# Altium project TC264MCU_V2_Project.PrjPcb
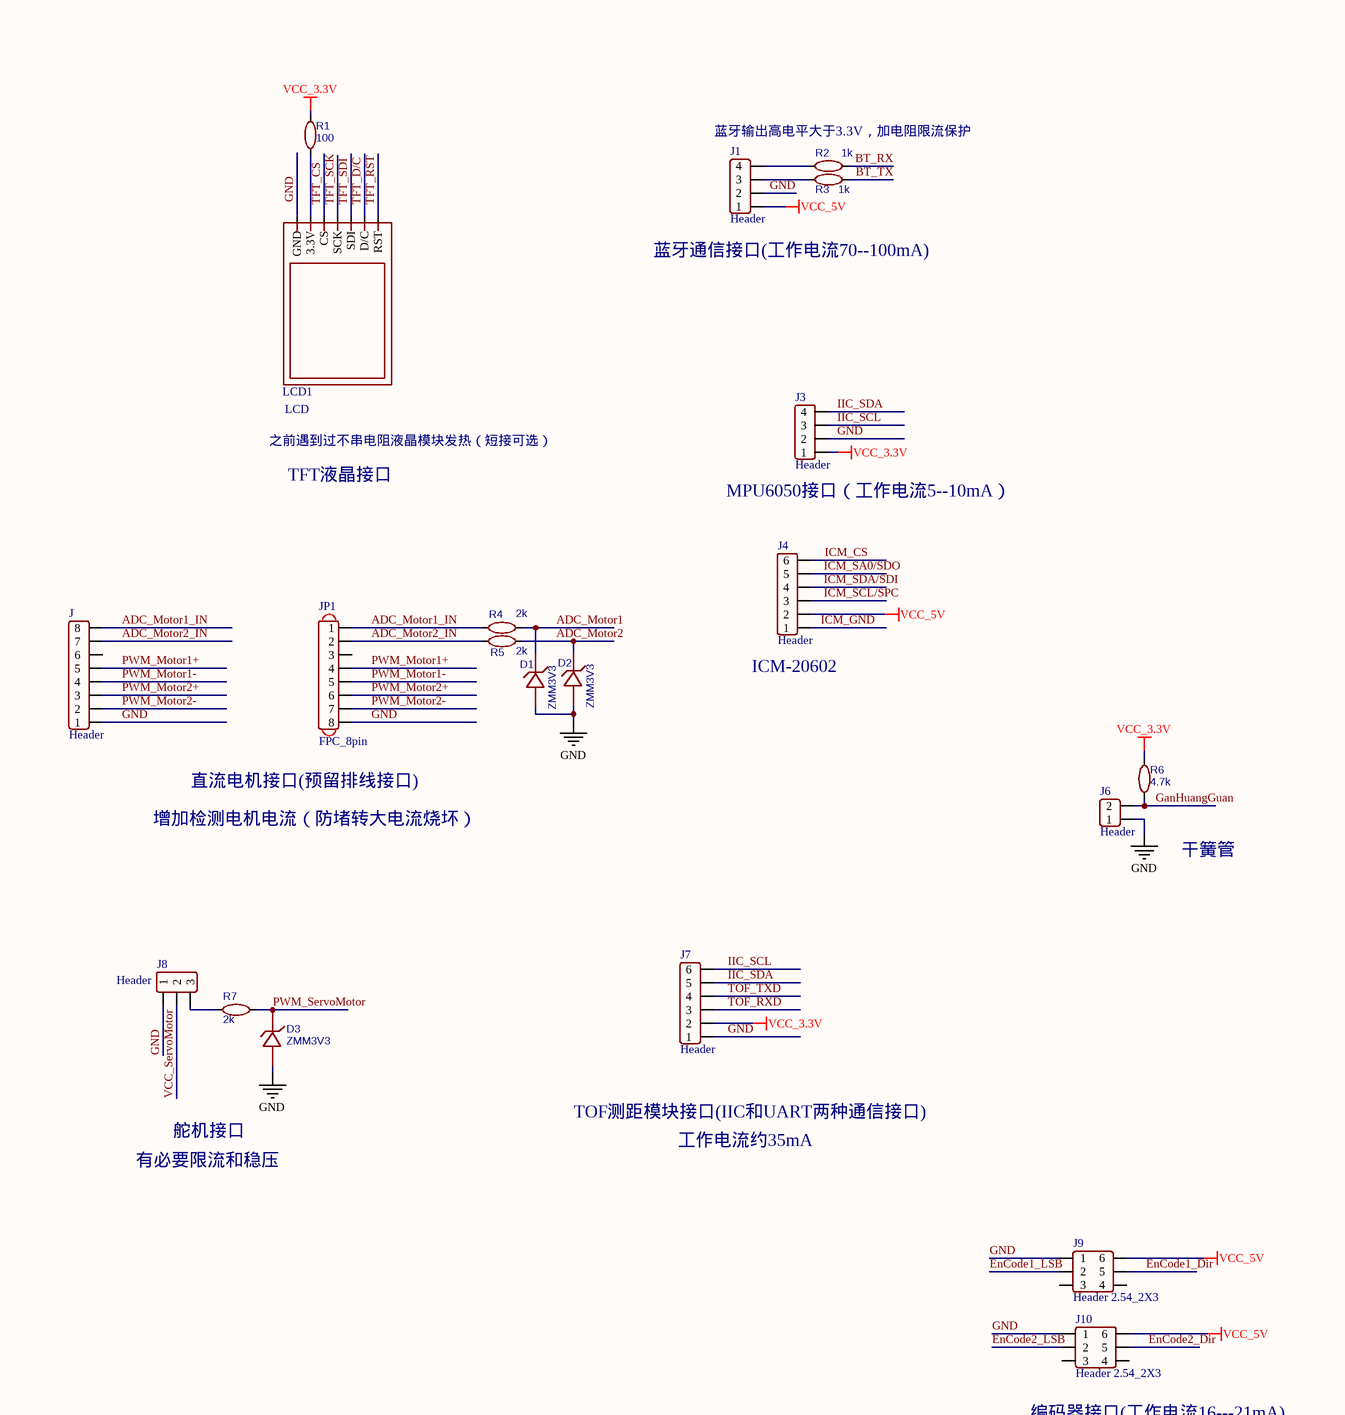
[diagram p0: TC264MCUV02.SchDoc, top left]
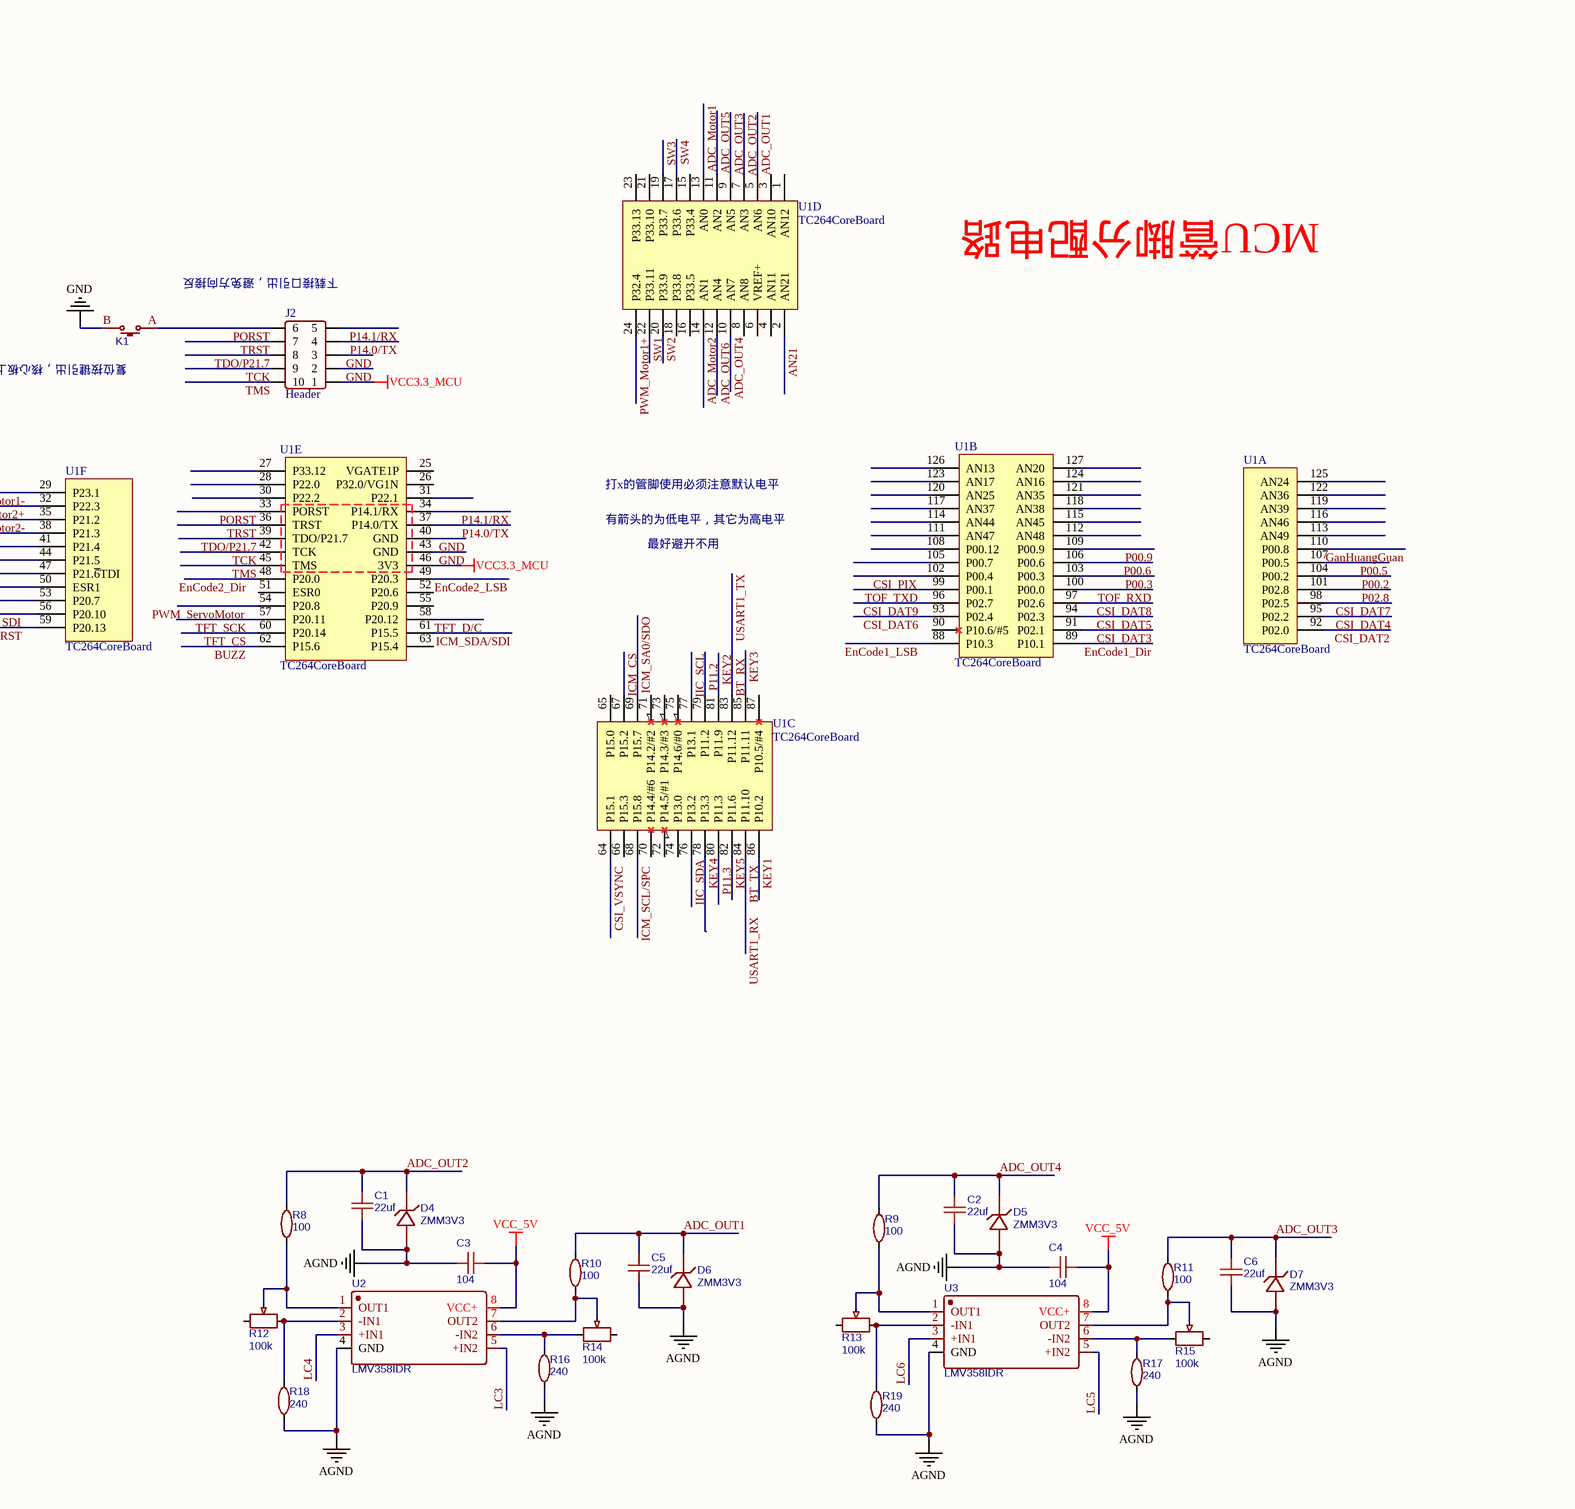
[diagram p1: TC264MCUV02.SchDoc, top right]
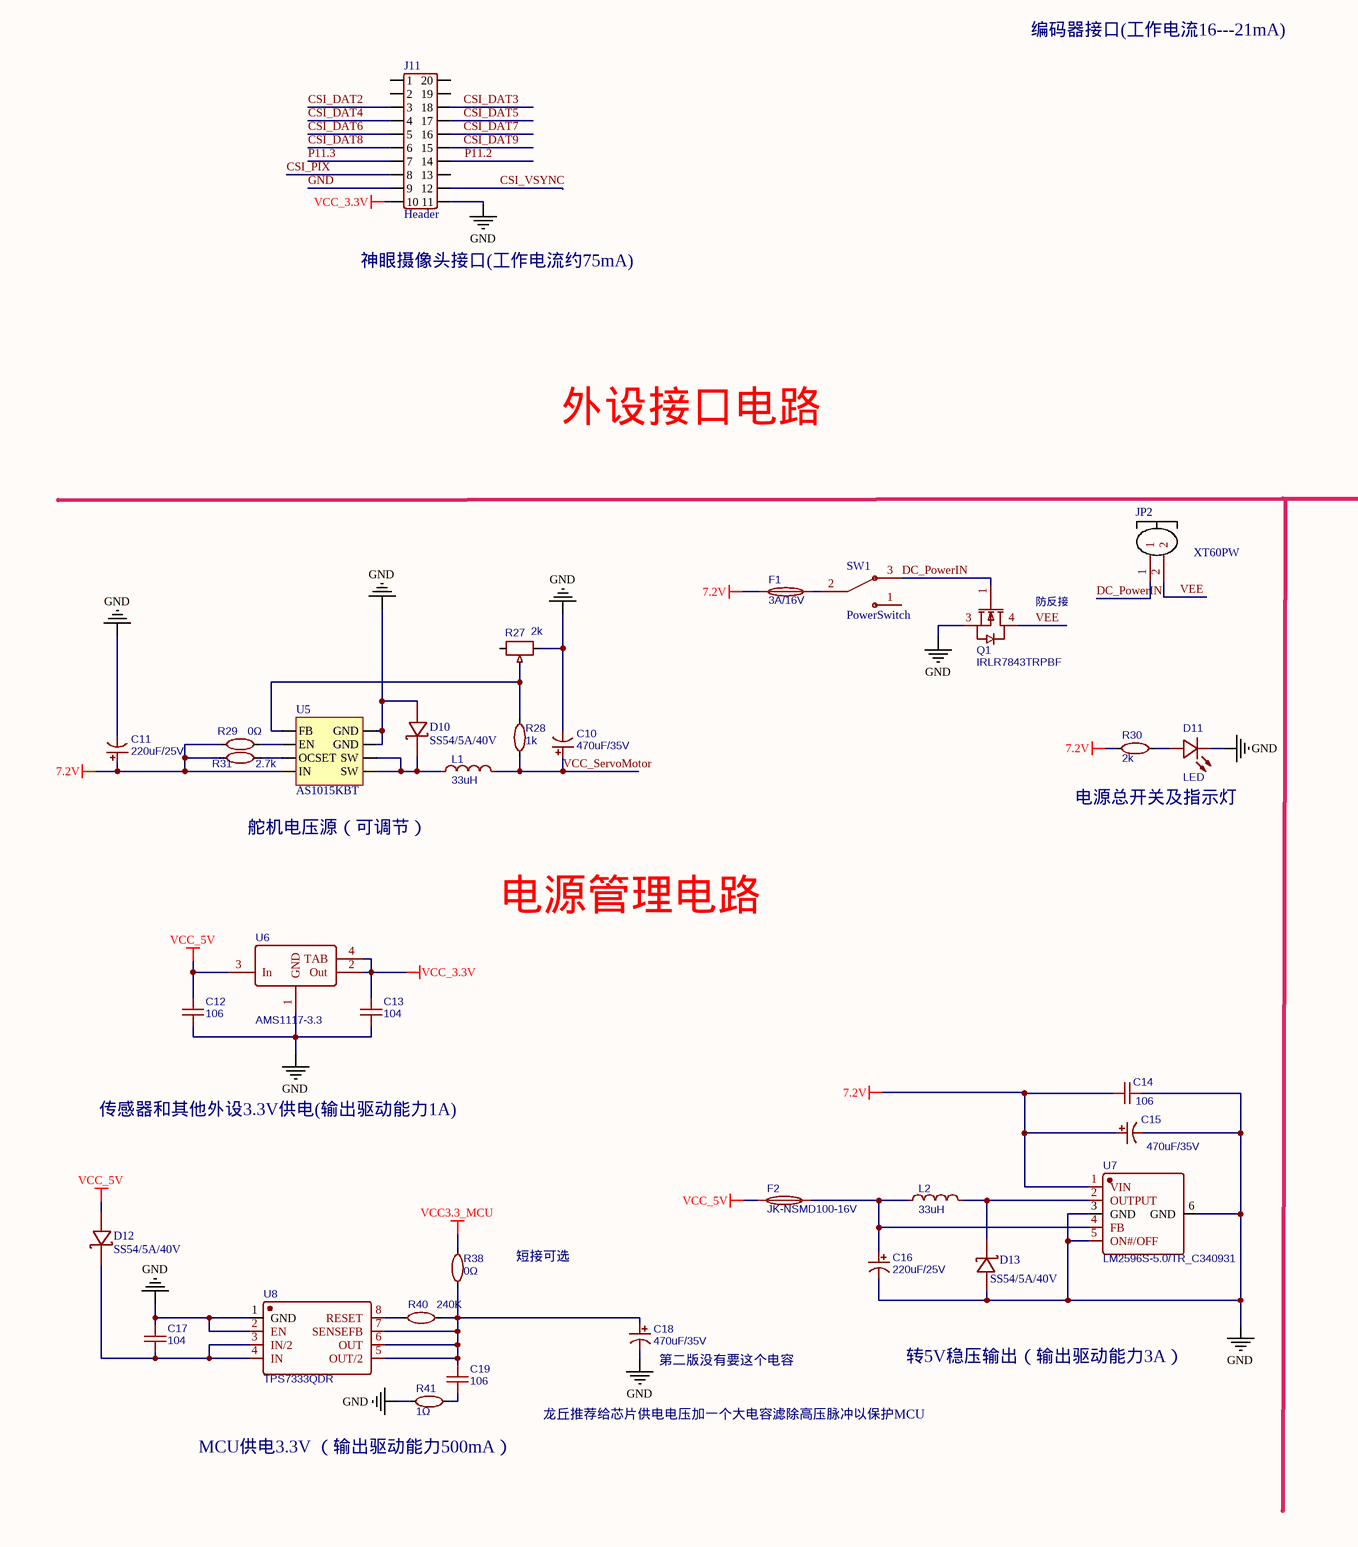
[diagram p2: TC264MCUV02.SchDoc, bottom left]
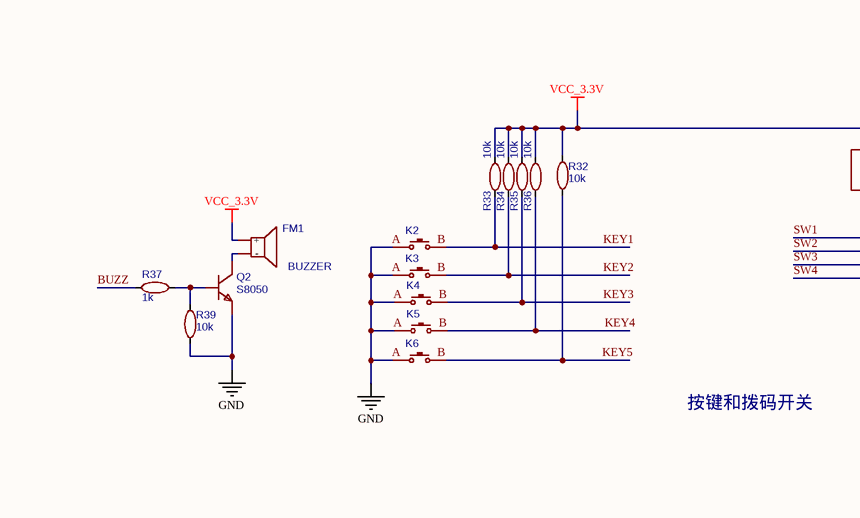
[diagram p3: TC264MCUV02.SchDoc, bottom middle]
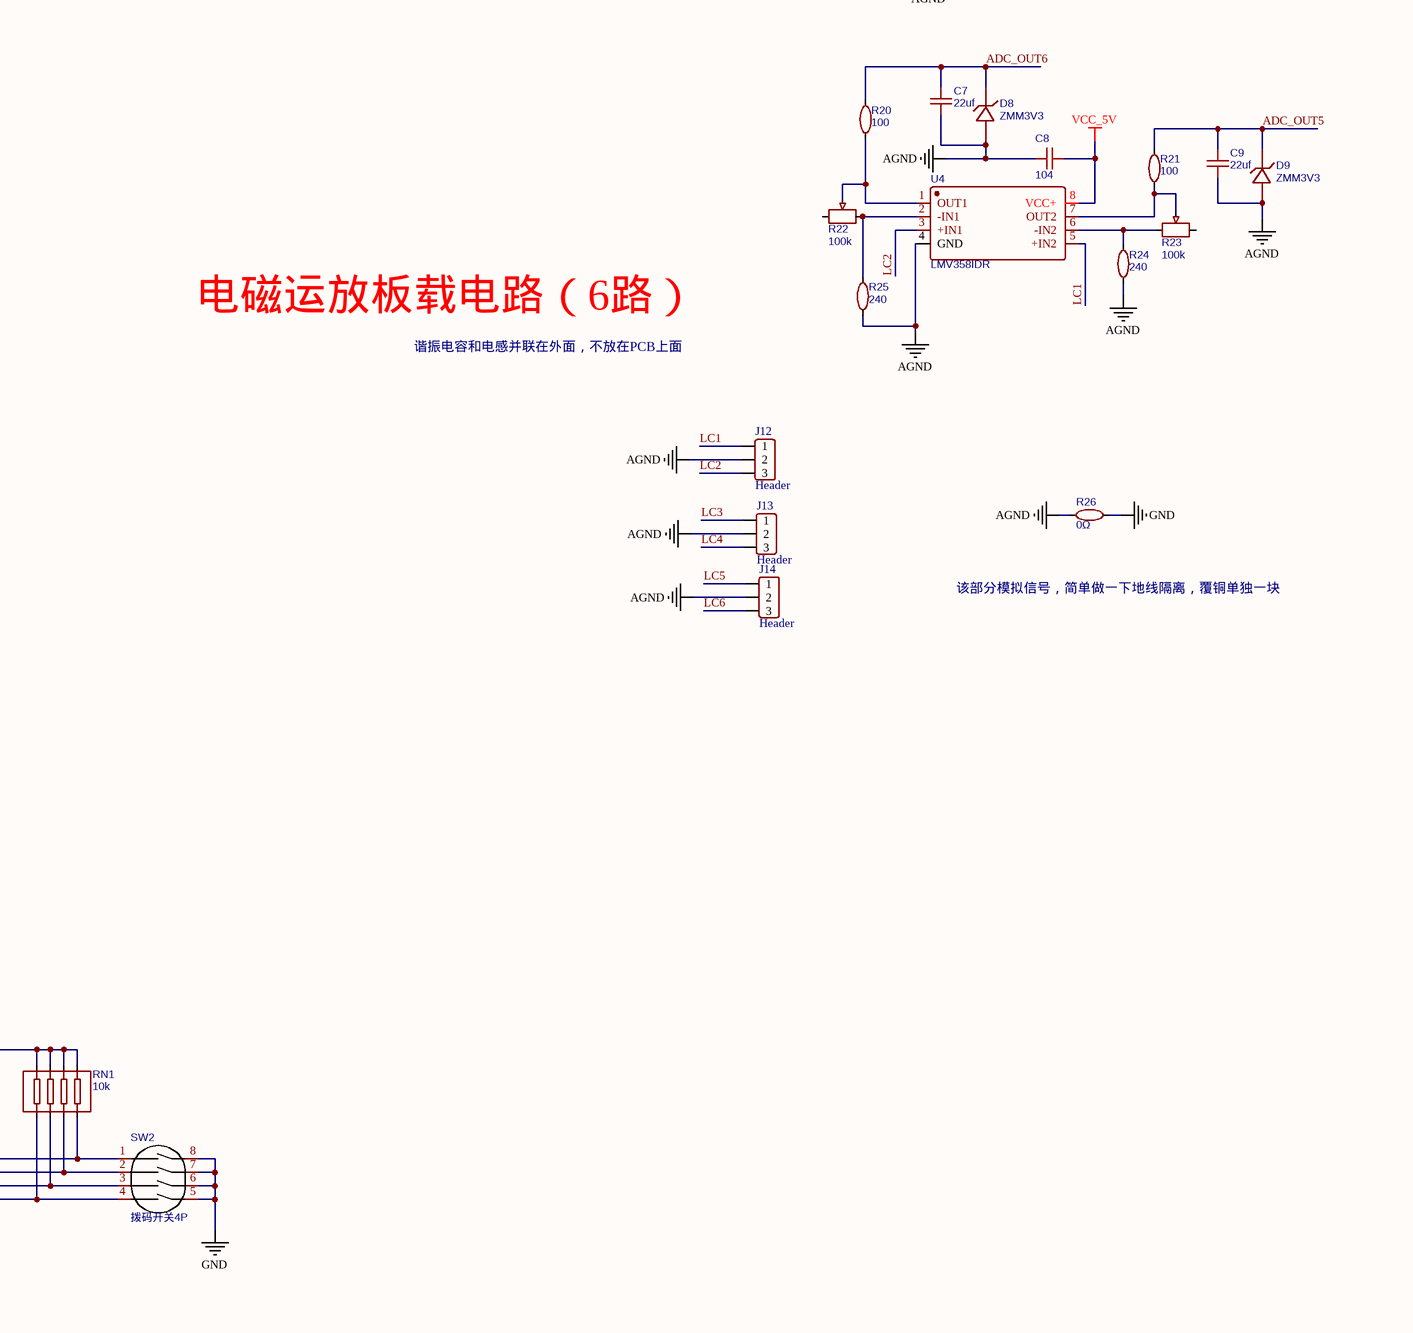
[diagram p4: TC264MCUV02.SchDoc, bottom right]
1 sheet, 114 parts. Net scope: global (net labels, ports and power ports of the same name join across sheets).
Board files: TC264MCUV02.PcbDoc, CarSizeofCforFourRounds.PcbDoc

## Sheet TC264MCUV02.SchDoc
size A1

### Parts
C1  22uf  [CAP_0603]
C2  22uf  [CAP_0603]
C3  104  [CAP_0603]
C4  104  [CAP_0603]
C5  22uf  [CAP_0603]
C6  22uf  [CAP_0603]
C7  22uf  [CAP_0603]
C8  104  [CAP_0603]
C9  22uf  [CAP_0603]
C10  470uF/35V  [CAPE_SMD_F_8.4]
C11  220uF/25V  [CAPE_SMD_F_8.4]
C12  106  [CAP_0603]
C13  104  [CAP_0603]
C14  106  [CAP_0603]
C15  470uF/35V  [CAPE_SMD_G_10.6]
C16  220uF/25V  [CAPE_SMD_F_8.4]
C17  104  [CAP_0603]
C18  470uF/35V  [CAPE_SMD_G_10.6]
C19  106  [CAP_0603]
D1  ZMM3V3  [LL-34_L3.5-W1.5-RD]
D2  ZMM3V3  [LL-34_L3.5-W1.5-RD]
D3  ZMM3V3  [LL-34_L3.5-W1.5-RD]
D4  ZMM3V3  [LL-34_L3.5-W1.5-RD]
D5  ZMM3V3  [LL-34_L3.5-W1.5-RD]
D6  ZMM3V3  [LL-34_L3.5-W1.5-RD]
D7  ZMM3V3  [LL-34_L3.5-W1.5-RD]
D8  ZMM3V3  [LL-34_L3.5-W1.5-RD]
D9  ZMM3V3  [LL-34_L3.5-W1.5-RD]
D10  SS54/5A/40V  [DO214_SMA]
D11  LED  [LED_0603_B]
D12  SS54/5A/40V  [DO214_SMA]
D13  SS54/5A/40V  [DO214_SMA]
F1  3A/16V  [FUSE_1210]
F2  JK-NSMD100-16V  [F1206]
FM1  BUZZER  [BUZZ-12*7.5]
J  Header  [Header 2.54X8]
J1  Header  [Header F 2.54X4]
J2  Header  [IDC_10P]
J3  Header  [Header 2.54X4]
J4  Header  [Header 2.54X6]
J6  Header  [HX2.54-2]
J7  Header  [Header 2.54X6]
J8  Header  [Header 2.54X3]
J9  Header 2.54_2X3  [IDC_6P]
J10  Header 2.54_2X3  [IDC_6P]
J11  Header  [Header F 2.54_2x10]
J12  Header  [Header 2.54X3]
J13  Header  [Header 2.54X3]
J14  Header  [Header 2.54X3]
JP1  FPC_8pin  [FPC_1.0_8P]
JP2  XT60PW  [XT60PW]
K1  TS-Button_2P  [SW_SMD_6.1*3.7]  (value not drawn)
K2  TS-Button_2P  [SW_SMD_6.1*3.7]  (value not drawn)
K3  TS-Button_2P  [SW_SMD_6.1*3.7]  (value not drawn)
K4  TS-Button_2P  [SW_SMD_6.1*3.7]  (value not drawn)
K5  TS-Button_2P  [SW_SMD_6.1*3.7]  (value not drawn)
K6  TS-Button_2P  [SW_SMD_6.1*3.7]  (value not drawn)
L1  33uH  [IND-SMD_L8.0-W8.0]
L2  33uH  [IND-SMD_L8.0-W8.0]
LCD1  LCD  [TFT_LCD]
Q1  IRLR7843TRPBF  [TO-252-2]
Q2  S8050  [SOT-23-3]
R1  100  [RES_0603]
R2  1k  [RES_0603]
R3  1k  [RES_0603]
R4  2k  [RES_0603]
R5  2k  [RES_0603]
R6  4.7k  [RES_0603]
R7  2k  [RES_0603]
R8  100  [RES_0603]
R9  100  [RES_0603]
R10  100  [RES_0603]
R11  100  [RES_0603]
R12  100k  [RES_POT-3296W]
R13  100k  [RES_POT-3296W]
R14  100k  [RES_POT-3296W]
R15  100k  [RES_POT-3296W]
R16  240  [RES_0603]
R17  240  [RES_0603]
R18  240  [RES_0603]
R19  240  [RES_0603]
R20  100  [RES_0603]
R21  100  [RES_0603]
R22  100k  [RES_POT-3296W]
R23  100k  [RES_POT-3296W]
R24  240  [RES_0603]
R25  240  [RES_0603]
R26  0Ω  [RES_0603]
R27  2k  [RES_POT-3296W]
R28  1k  [RES_0603]
R29  0Ω  [RES_0603]
R30  2k  [RES_0603]
R31  2.7k  [RES_0603]
R32  10k  [RES_0603]
R33  10k  [RES_0603]
R34  10k  [RES_0603]
R35  10k  [RES_0603]
R36  10k  [RES_0603]
R37  1k  [RES_0603]
R38  0Ω  [RES_0603]
R39  10k  [RES_0603]
R40  240K  [RES_0603]
R41  1Ω  [RES_0603]
RN1  10k  [RES-ARRAY-SMD_0603-8P-L3.2-W1.6-BL]
SW1  PowerSwitch  [SW-TH_K3-1260D-K1]
SW2  拨码开关4P  [VDG/S-04HG-R]
U1  TC264CoreBoard  [LQ-TC264-SYSVC-S]  (parts A,B,C,D,E,F of 6)
U2  LMV358IDR  [SOIC-8_150MIL]
U3  LMV358IDR  [SOIC-8_150MIL]
U4  LMV358IDR  [SOIC-8_150MIL]
U5  AS1015KBT  [SOIC-8_150MIL]
U6  AMS1117-3.3  [SOT-223_3]
U7  LM2596S-5.0/TR_C340931  [TO-263_5]
U8  TPS7333QDR  [SOIC-8_150MIL]

### Nets
7.2V: C11.1 C14.1 C15.1 F1.2 R29.1 R30.2 R31.1 U5.4(IN) U7.1(VIN)
AGND: C1.2 C2.2 C3.2 C4.2 C5.2 C6.2 C7.2 C8.2 C9.2 D4.2(A) D5.2(A) D6.2(A) D7.2(A) D8.2(A) D9.2(A) J12.2 J13.2 J14.2 R16.1 R17.1 R18.2 R19.2 R24.1 R25.2 R26.1 U2.4(GND) U3.4(GND) U4.4(GND)
GND: C10.2 C11.2 C12.2 C13.2 C14.2 C15.2 C16.2 C17.1 C18.2 D1.2(A) D2.2(A) D3.2(A) D10.1(A) D11.C D13.1(A) J.1 J1.2 J2.2 J2.3 J3.2 J6.1 J7.1 J8.1 J9.1 J10.1 J11.9 J11.11 JP1.8 K1.B K2.A K3.A K4.A K5.A K6.A LCD1.1(GND) Q1.3(S) Q2.2(E) R26.2 R27.1 R39.2 R41.1 SW2.5 SW2.6 SW2.7 SW2.8 U1.40(GND) U1.43(GND) U5.7(GND) U5.8(GND) U6.1(GND) U7.3(GND) U7.5(ON#/OFF) U7.6(GND) U8.1(GND) U8.2(EN)
VCC3.3_MCU: J2.1 R38.2 U1.46(3V3)
VCC_3.3V: C13.1 FM1.1(+) J3.1 J7.2 J11.10 R1.1 R6.1 R32.2 R33.2 R34.2 R35.2 R36.2 RN1.5 RN1.6 RN1.7 RN1.8 U6.2(Out) U6.4(TAB)
VCC_5V: C3.1 C4.1 C8.1 C12.1 D12.1(A) F2.2 J1.1 J4.2 J9.6 J10.6 U2.8(VCC+) U3.8(VCC+) U4.8(VCC+) U6.3(In)
ADC_Motor1: D1.1(C) R4.1 U1.13(AN0)
ADC_Motor1_IN: J.8 JP1.1 R4.2
ADC_Motor2: D2.1(C) R5.1 U1.14(AN1)
ADC_Motor2_IN: J.7 JP1.2 R5.2
ADC_OUT1: C5.1 D6.1(C) R10.1 U1.5(AN6)
ADC_OUT2: C1.1 D4.1(C) R8.1 U1.7(AN3)
ADC_OUT3: C6.1 D7.1(C) R11.1 U1.9(AN5)
ADC_OUT4: C2.1 D5.1(C) R9.1 U1.10(AN7)
ADC_OUT5: C9.1 D9.1(C) R21.1 U1.11(AN2)
ADC_OUT6: C7.1 D8.1(C) R20.1 U1.12(AN4)
AN21: U1.2(AN21)
BT_RX: R2.1 U1.83(P11.12)  [also labelled USART1_TX]
BT_TX: R3.1 U1.84(P11.10)  [also labelled USART1_RX]
BUZZ: R37.2 U1.62(P15.6)
CSI_DAT2: J11.3 U1.92(P02.0)
CSI_DAT3: J11.18 U1.91(P02.1)
CSI_DAT4: J11.4 U1.95(P02.2)
CSI_DAT5: J11.17 U1.94(P02.3)
CSI_DAT6: J11.5 U1.93(P02.4)
CSI_DAT7: J11.16 U1.98(P02.5)
CSI_DAT8: J11.6 U1.97(P02.6)
CSI_DAT9: J11.15 U1.96(P02.7)
CSI_PIX: J11.8 U1.102(P00.4)
CSI_VSYNC: J11.12 U1.64(P15.1)
DC_PowerIN: JP2.1 Q1.1(G) SW1.3(NC)
EnCode1_Dir: J9.5 U1.89(P10.1)
EnCode1_LSB: J9.2 U1.88(P10.3)
EnCode2_Dir: J10.5 U1.48(P20.0)
EnCode2_LSB: J10.2 U1.49(P20.3)
GanHuangGuan: J6.2 R6.2 U1.110(P00.8)
ICM_CS: J4.6 U1.67(P15.2)
ICM_GND: J4.1
ICM_SA0/SDO: J4.5 U1.69(P15.7)
ICM_SCL/SPC: J4.3 U1.68(P15.8)
ICM_SDA/SDI: J4.4 U1.61(P15.5)
IIC_SCL: J3.3 J7.6 U1.77(P13.1)
IIC_SDA: J3.4 J7.5 U1.76(P13.2)
KEY1: K2.B R33.1 U1.86(P10.2)
KEY2: K3.B R34.1 U1.81(P11.9)
KEY3: K4.B R35.1 U1.85(P11.11)
KEY4: K5.B R36.1 U1.78(P13.3)
KEY5: K6.B R32.1 U1.82(P11.6)
LC1: J12.1 U4.5(+IN2)
LC2: J12.3 U4.3(+IN1)
LC3: J13.1 U2.5(+IN2)
LC4: J13.3 U2.3(+IN1)
LC5: J14.1 U3.5(+IN2)
LC6: J14.3 U3.3(+IN1)
P00.2: U1.104(P00.2)
P00.3: U1.103(P00.3)
P00.5: U1.107(P00.5)
P00.6: U1.106(P00.6)
P00.9: U1.109(P00.9)
P02.8: U1.101(P02.8)
P11.2: J11.14 U1.79(P11.2)
P11.3: J11.7 U1.80(P11.3)
P14.0/TX: J2.4 U1.37(P14.0/TX)
P14.1/RX: J2.5 U1.34(P14.1/RX)
PORST: J2.6 K1.A U1.33(PORST)
PWM_Motor1+: J.5 JP1.4 U1.24(P32.4)
PWM_Motor1-: J.4 JP1.5 U1.29(P23.1)
PWM_Motor2+: J.3 JP1.6 U1.32(P22.3)
PWM_Motor2-: J.2 JP1.7 U1.35(P21.2)
PWM_ServoMotor: D3.1(C) R7.1 U1.54(P20.8)
SW1: RN1.4 SW2.1 U1.22(P33.11)
SW2: RN1.3 SW2.2 U1.20(P33.9)
SW3: RN1.2 SW2.3 U1.19(P33.7)
SW4: RN1.1 SW2.4 U1.17(P33.6)
TCK: J2.9 U1.42(TCK)
TDO/P21.7: J2.8 U1.39(TDO/P21.7)
TFT_CS: LCD1.3(CS) U1.60(P20.14)
TFT_D/C: LCD1.6(D/C) U1.58(P20.12)
TFT_RST: LCD1.7(RST) U1.59(P20.13)
TFT_SCK: LCD1.4(SCK) U1.57(P20.11)
TFT_SDI: LCD1.5(SDI) U1.56(P20.10)
TMS: J2.10 U1.45(TMS)
TOF_RXD: J7.3 U1.100(P00.0)
TOF_TXD: J7.4 U1.99(P00.1)
TRST: J2.7 U1.36(TRST)
VCC_ServoMotor: C10.1 J8.2 L1.2 R28.1
VEE: JP2.2 Q1.4(D)
NetC16_1: C16.1 F2.1 L2.1 U7.4(FB)
NetC17_2: C17.2 D12.2(C) U8.3(IN/2) U8.4(IN)
NetC18_1: C18.1 C19.1 R38.1 R40.2 U8.5(OUT/2) U8.6(OUT) U8.7(SENSEFB)
NetC19_2: C19.2 R41.2
NetD10_2: D10.2(C) L1.1 U5.5(SW) U5.6(SW)
NetD11_A: D11.A R30.1
NetD13_2: D13.2(C) L2.2 U7.2(OUTPUT)
NetF1_1: F1.1 SW1.2(C)
NetFM1_2: FM1.2(－) Q2.3(C)
NetJ1_3: J1.3 R3.2
NetJ1_4: J1.4 R2.2
NetJ8_3: J8.3 R7.2
NetLCD1_2: LCD1.2(3.3V) R1.2
NetQ2_1: Q2.1(B) R37.1 R39.1
NetR8_2: R8.2 R12.2 U2.1(OUT1)
NetR9_2: R9.2 R13.2 U3.1(OUT1)
NetR10_2: R10.2 R14.2 U2.7(OUT2)
NetR11_2: R11.2 R15.2 U3.7(OUT2)
NetR12_3: R12.3 R18.1 U2.2(-IN1)
NetR13_3: R13.3 R19.1 U3.2(-IN1)
NetR14_1: R14.1 R16.2 U2.6(-IN2)
NetR15_1: R15.1 R17.2 U3.6(-IN2)
NetR20_2: R20.2 R22.2 U4.1(OUT1)
NetR21_2: R21.2 R23.2 U4.7(OUT2)
NetR22_3: R22.3 R25.1 U4.2(-IN1)
NetR23_1: R23.1 R24.2 U4.6(-IN2)
NetR27_2: R27.2 R28.2 U5.1(FB)
NetR29_2: R29.2 U5.2(EN)
NetR31_2: R31.2 U5.3(OCSET)
NetR40_1: R40.1 U8.8(RESET)

Not connected (* = marked no-connect by the designer): J 6; J9 3 4; J10 3 4; J11 1 2 13 19 20; JP1 3; R12 1; R13 1; R14 3; R15 3; R22 1; R23 3; R27 3; SW1 1(ON); U1 1(AN12) 3(AN10) 4(AN11) 6(VREF+) 8(AN8) 15(P33.4) 16(P33.5) 18(P33.8) 21(P33.10) 23(P33.13) 25(VGATE1P) 26(P32.0/VG1N) 27(P33.12) 28(P22.0) 30(P22.2) 31(P22.1) 38(P21.3) 41(P21.4) 44(P21.5) 47(P21.~{6}TDI) 50(ESR1) 51(ESR0) 52(P20.6) 53(P20.7) 55(P20.9) 63(P15.4) 65(P15.0) 66(P15.3) 70(P14.4/#6) 71(P14.2/#2) 72(P14.5/#1) 73(P14.3/#3) 74(P13.0) 75(P14.6/#0) 87(P10.5/#4) 90(P10.6/#5) 105(P00.7) 108(P00.12) 111(AN47) 112(AN48) 113(AN49) 114(AN44) 115(AN45) 116(AN46) 117(AN37) 118(AN38) 119(AN39) 120(AN25) 121(AN35) 122(AN36) 123(AN17) 124(AN16) 125(AN24) 126(AN13) 127(AN20)

### Notes on the sheet
- 蓝牙输出高电平大于3.3V，加电阻限流保护
- MCU管脚分配电路
- (near J1) 蓝牙通信接口(工作电流70--100mA)
- (near J2) 下载接口引出，避免方向接反
- (near K1) 复位按键引出，核心板上已经加了上拉电阻和电容
- 之前遇到过不串电阻液晶模块发热（短接可选）
- 打x的管脚使用必须注意默认电平
- 有箭头的为低电平，其它为高电平
- TFT液晶接口
- (near J3) MPU6050接口（工作电流5--10mA）
- 最好避开不用
- (near J4) ICM-20602
- 直流电机接口(预留排线接口)
- 增加检测电机电流（防堵转大电流烧坏）
- 干簧管
- 舵机接口
- TOF测距模块接口(IIC和UART两种通信接口)
- 有必要限流和稳压
- 工作电流约35mA
- (near J10) 编码器接口(工作电流16---21mA)
- (near J11) 神眼摄像头接口(工作电流约75mA)
- 电磁运放板载电路（6路）
- 外设接口电路
- 谐振电容和电感并联在外面，不放在PCB上面
- (near Q1) 防反接
- 该部分模拟信号，简单做一下地线隔离，覆铜单独一块
- 舵机电压源（可调节）
- 电源总开关及指示灯
- 电源管理电路
- 传感器和其他外设3.3V供电(输出驱动能力1A)
- 短接可选
- (near C18) 第二版没有要这个电容
- 转5V稳压输出（输出驱动能力3A）
- 按键和拨码开关
- 龙丘推荐给芯片供电电压加一个大电容滤除高压脉冲以保护MCU
- (near R41) MCU供电3.3V （输出驱动能力500mA）

### Library data of the parts
C1-C9 C12-C14 C17 C19 = CAP_0603: BOM_Manufacturer: Samsung Electro-Mechanics; BOM_Manufacturer Part: CL10B104KB8WPNC; nameAlias: Capacitance; Contributor: LCSC; BOM_Supplier: LCSC; BOM_Supplier Part: C307348; spicePre: C; spiceSymbolName: CL10B104KB8WPNC
C10 C11 C15 C16 C18 = CAP_E_SMD: 贴片电解电容; BOM_Manufacturer: ROQANG; BOM_Manufacturer Part: RVT1C221M0607; nameAlias: Capacitance; BOM_Supplier: LCSC; BOM_Supplier Part: C72496; spicePre: C; spiceSymbolName: RVT1C221M0607
D1-D9 = ZMM3V3: BOM_Manufacturer: SEMTECH; SMT Type: Basic; BOM_Supplier: LCSC; BOM_Manufacturer Part: ZMM3V3; BOM_LCSC Assembly: Yes; image: //image.lceda.cn/szlcsc/C8056.jpg; BOM_Supplier Part: C8056; spicePre: D; spiceSymbolName: ZMM3V3
D10 D12 D13 = SS54
D11 = LED_0603: 发光LED; BOM_Manufacturer: ARKLED; BOM_Manufacturer Part: D-G080508G1; Contributor: LCSC; BOM_Supplier: LCSC; BOM_Supplier Part: C107402; spicePre: L; spiceSymbolName: D-G080508G1
F1 F2 = JK-NSMD100-16V: BOM_Manufacturer: Jinrui Electronic Materials Co.; Contributor: LCSC; BOM_Supplier: LCSC; BOM_Supplier Part: C369161; BOM_Manufacturer Part: JK-NSMD100-16V; spicePre: F; spiceSymbolName: JK-NSMD100-16V
FM1 = BUZZER: 蜂鸣器; BOM_Manufacturer: HNDZ; BOM_Manufacturer Part: TMB12A12; BOM_Supplier: LCSC; BOM_Supplier Part: C96079; spicePre: B; spiceSymbolName: TMB12A12
J = Header 2.54_8
J1 J3 = Header 2.54_4
J2 = Header 2.54_2X5
J4 J7 = Header 2.54_6
J6 = Header 2.54_2
J8 J12-J14 = Header 2.54_3
J11 = Header 2.54_2X10
K1-K6 = TS-Button_2P: 贴片按键 3*6*2.5; BOM_Manufacturer: XUNPU; BOM_Manufacturer Part: TS-1007S-26; Contributor: LCSC; BOM_Supplier: LCSC; BOM_Supplier Part: C455236; spicePre: S; spiceSymbolName: TS-1007S-26
L1 L2 = Inductor: BOM_Manufacturer: TDK; BOM_Manufacturer Part: NLV25T-330J-EF; nameAlias: Inductance; Contributor: LCSC; BOM_Supplier: LCSC; BOM_Supplier Part: C295130; spicePre: L; spiceSymbolName: NLV25T-330J-EF
LCD1 = TFT-LCD
Q1 = IRLR7843TRPBF: MOS管; BOM_Manufacturer: IR; SMT Type: Extend; BOM_Supplier: LCSC; BOM_Manufacturer Part: IRLR7843TRPBF; image: //image.lceda.cn/szlcsc/C21988.jpg; BOM_Supplier Part: C21988; BOM_LCSC Assembly: Yes; spicePre: Q; spiceSymbolName: IRLR7843TRPBF
Q2 = S8050: 三极管NPN; BOM_Manufacturer: FH; BOM_Manufacturer Part: FHT9014Y-ME; SMT Type: Extend; BOM_Supplier: LCSC; BOM_Supplier Part: C88861; BOM_LCSC Assembly: Yes; spicePre: Q; spiceSymbolName: FHT9014Y-ME
R1-R11 R16-R21 R24-R26 R28-R41 = RES_0603: BOM_Manufacturer: YAGEO; BOM_Manufacturer Part: RC0402JR-07100KL; nameAlias: Resistance (Ohms); BOM_Supplier: LCSC; BOM_Supplier Part: C106234; spicePre: R; spiceSymbolName: RC0402JR-07100KL
R12-R15 R22 R23 = RES_POT-3296W: 可调电阻3296W; BOM_Manufacturer: Chengdu Guosheng Tech; BOM_Manufacturer Part: 3296W-1-104; nameAlias: Resistance (Ohms); Contributor: LCSC; BOM_Supplier: LCSC; BOM_Supplier Part: C118963; Resistance(Ohms): 100K; spicePre: R; spiceSymbolName: 3296W-1-104
R27 = RES_POT-3296W: 可调电阻3296W; BOM_Manufacturer: Chengdu Guosheng Tech; BOM_Manufacturer Part: 3296W-1-104; Resistance(Ohms): 100K; nameAlias: Resistance (Ohms); Contributor: LCSC; BOM_Supplier: LCSC; BOM_Supplier Part: C118963; spicePre: R; spiceSymbolName: 3296W-1-104
RN1 = RESW4: BOM_Manufacturer: YAGEO; BOM_Manufacturer Part: YC164-JR-0710KL; nameAlias: Resistance (Ohms); BOM_Supplier: LCSC; BOM_Supplier Part: C107374; spicePre: R; spiceSymbolName: YC164-JR-0710KL
SW2 = 拨码开关4P: DIP_4PX2*2.54; BOM_Manufacturer: ReliaPro; BOM_Supplier: LCSC; BOM_Manufacturer Part: VDG/S-04HG-R; image: //image.lceda.cn/szlcsc/C15781.jpg; BOM_Supplier Part: C15781; spicePre: D; spiceSymbolName: VDG/S-04HG-R
U2-U4 = LMV358IDR: BOM_Manufacturer: TI; SMT Type: Extend; BOM_Supplier: LCSC; BOM_Manufacturer Part: LMV358IDR; BOM_Supplier Part: C63813; BOM_LCSC Assembly: Yes; spicePre: U; spiceSymbolName: LMV358IDR
U6 = AMS1117-3.3: BOM_Manufacturer: SK; Contributor: LCSC; SMT Type: Extend; BOM_Supplier: LCSC; BOM_Supplier Part: C165482; BOM_Manufacturer Part: AMS1117-3.3; BOM_LCSC Assembly: Yes; spicePre: U; spiceSymbolName: AMS1117-3.3_C165482
U7 = LM2596S-5.0/TR_C340931: BOM_Manufacturer: Huaguan Semicon; Contributor: LCSC; BOM_Supplier: LCSC; BOM_Supplier Part: C340931; BOM_Manufacturer Part: LM2596S-5.0/TR; spicePre: U; spiceSymbolName: LM2596S-5.0/TR_C340931
U8 = TPS7333QDR: BOM_Manufacturer: TI; SMT Type: Extend; spicePre: X; BOM_Supplier: LCSC; BOM_Manufacturer Part: TPS7333QDR; image: //image.lceda.cn/szlcsc/C23791.jpg; BOM_Supplier Part: C23791; BOM_LCSC Assembly: Yes; spiceSymbolName: TPS7333QDR